# Altium schematic sheet mcu.SchDoc
size A; SheetNumber: 1; SheetTotal: 4
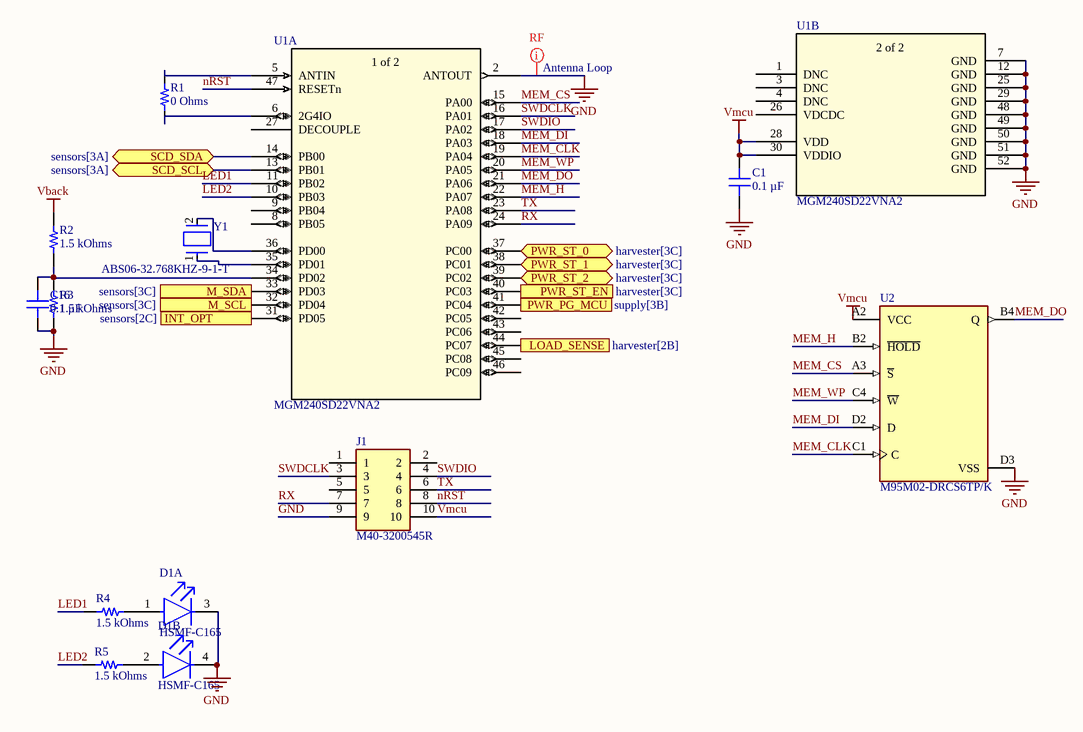
[diagram p0: mcu.SchDoc]

## Parts
C1  0.1 µF  [CAP 0402_1005]
C16  0.1 µF  [CAP 0402_1005]
D1  HSMF-C165  [FP-HSMF-C165-MFG]  (parts A,B of 2)
J1  M40-3200545R  [HARWIN_M40-3200545R]
R1  0 Ohms  [RES 0201_0603]
R2  1.5 kOhms  [RES 0402_1005]
R3  1.5 kOhms  [RES 0402_1005]
R4  1.5 kOhms  [RES 0402_1005]
R5  1.5 kOhms  [RES 0402_1005]
U1  MGM240SD22VNA2  [xGM240S]  (parts A,B of 2)
U2  M95M02-DRCS6TP/K  [FP-WLCSP8-E1c_WLCSP8_noBS-MFG]
Y1  ABS06-32.768KHZ-9-1-T  [FP-ABS06-MFG]

## Ports
INT_OPT (in, see sensors[2C]), LOAD_SENSE (see harvester[2B]), M_SCL (see sensors[3C]), M_SDA (see sensors[3C]), PWR_PG_MCU (in, see supply[3B]), PWR_ST_0 (bidir, see harvester[3C]), PWR_ST_1 (bidir, see harvester[3C]), PWR_ST_2 (bidir, see harvester[3C]), PWR_ST_EN (out, see harvester[3C]), SCD_SCL (bidir, see sensors[3A]), SCD_SDA (bidir, see sensors[3A])

## Nets
GND: C1.1 C16.1 D1.3(GREEN_C) D1.4(RED_C) J1.9 R3.2 U1.2(ANTOUT) U1.7(GND) U1.12(GND) U1.25(GND) U1.29(GND) U1.48(GND) U1.49(GND) U1.50(GND) U1.51(GND) U1.52(GND) U2.D3(VSS)
Vback: R2.1
Vmcu: C1.2 J1.10 U1.28(VDD) U1.30(VDDIO) U2.A2(VCC)
INT_OPT: U1.31(PD05) ; port INT_OPT
LED1: R4.2 U1.11(PB02)
LED2: R5.2 U1.10(PB03)
LOAD_SENSE: U1.44(PC07) ; port LOAD_SENSE
M_SCL: U1.32(PD04) ; port M_SCL
M_SDA: U1.33(PD03) ; port M_SDA
MEM_CLK: U1.19(PA04) U2.C1(C)
MEM_CS: U1.15(PA00) U2.A3(~{S})
MEM_DI: U1.18(PA03) U2.D2(D)
MEM_DO: U1.21(PA06) U2.B4(Q)
MEM_H: U1.22(PA07) U2.B2(~{HOLD})
MEM_WP: U1.20(PA05) U2.C4(~{W})
nRST: J1.8 U1.47(RESETn)
PWR_PG_MCU: U1.41(PC04) ; port PWR_PG_MCU
PWR_ST_0: U1.37(PC00) ; port PWR_ST_0
PWR_ST_1: U1.38(PC01) ; port PWR_ST_1
PWR_ST_2: U1.39(PC02) ; port PWR_ST_2
PWR_ST_EN: U1.40(PC03) ; port PWR_ST_EN
RX: J1.7 U1.24(PA09)
SCD_SCL: U1.13(PB01) ; port SCD_SCL
SCD_SDA: U1.14(PB00) ; port SCD_SDA
SWDCLK: J1.3 U1.16(PA01)
SWDIO: J1.4 U1.17(PA02)
TX: J1.6 U1.23(PA08)
NetC16_2: C16.2 R2.2 R3.1 U1.34(PD02)
NetD1_1: D1.1(GREEN_A) R4.1
NetD1_2: D1.2(RED_A) R5.1
NetR1_1: R1.1 U1.6(2G4IO)
NetR1_2: R1.2 U1.5(ANTIN)
NetU1_35: U1.35(PD01) Y1.1
NetU1_36: U1.36(PD00) Y1.2

Not connected (* = marked no-connect by the designer): J1 1 2 5; U1 1(DNC) 3(DNC) 4(DNC) 8(PB05) 9(PB04) 26(VDCDC) 27(DECOUPLE) 42(PC05) 43(PC06) 45(PC08) 46(PC09)

## Layout directives
mark named RF: GND

## Notes on the sheet
- Antenna Loop
- (in symbol MGM240SD22VNA2, part A) 1 of 2
- (in symbol MGM240SD22VNA2, part B) 2 of 2

## Library data of the parts
C1 C16 = C0402C104K7PAC7867: CAP CER 0.1UF 4V X5R 0402; manufacturer: KEMET; Tolerance: ±10%; Part Number: C0402C104K7PAC7867; Value: 0.1 µF; Applications: Bypass, Decoupling; Capacitance: 0.1 µF; componentlink1description: Datasheet; componentlink1url: https://api.kemet.com/component-edge/download/datasheet/C0402C104K7PAC7867.pdf; componentlink2description: DigiKey Link; componentlink2url: https://www.digikey.com/en/products/detail/kemet/C0402C104K7PAC7867/7381987; Device Package: 0402 (1005 Metric); lastupdated: 1/9/2022 12:30:40 pm; Lifecycle Status: Active; Minimum Order: 1; Mounting Type: Surface Mount, MLCC; Operating Temperature: -55°C ~ 85°C; Package / Case: 0402 (1005 Metric); packaging: TapeAndReel; partid: 5603; Part Status: Active; price: 0.01; series: SMD Comm X5R; Size / Dimension: 0.039" L x 0.020" W (1.00mm x 0.50mm); Supplier 1: DigiKey; Supplier Part Number 1: 399-14871-1-ND; Temperature Coefficient: X5R; Thickness (Max): 0.022" (0.55mm); Voltage - Rated: 4V
D1 = CMP-2000-06424-2: LED GREEN/RED DIFFUSED 0603 SMD; Reverse Voltage: 5V; Dominant Wavelength: 621nm; Number of Elements: 2; Shape: Rectangular; Luminous Intensity: 10mcd; Forward Current: 20mA; Lens Color: White; Illumination Color: Green; Power Dissipation: 52mW; Wavelength: 572nm; Viewing Angle: 120°; Forward Voltage: 2.2V; Max Operating Temperature: 85°C; Lens Transparency: Diffused; Width: 0.8mm; Case/Package: 0603; Packaging: Tape and Reel; Case Code (Metric): 1608; Depth: 0.8mm; REACH SVHC: No SVHC; Number of LEDs: 2; Radiation Hardening: No; Lens Style: Rectangular; Color: Green; Case Code (Imperial): 0603; Min Operating Temperature: -40°C; Power Rating: 52mW; Number of Pins: 4; Number of Terminals: 4; Package Quantity: 1; Mount: Surface Mount; Height: 0.5mm; Length: 1.6mm; Lead Free: Lead Free; Test Current: 20mA
J1 = M40-3200545R: Connector Header Surface Mount 10 position 0.039 _1.00mm_; MF: Harwin Inc.; Package: None; MP: M40-3200545R; Value: *; Price: None; SnapEDA_Link: https://www.snapeda.com/parts/M40-3200545R/Harwin%20Inc./view-part/494409/?ref=snap; Availability: Unavailable
R1 = CRG0201F10R: RES SMD 10 OHM 1% 1/20W 0201; Manufacturer: TE Connectivity Passive Product; Power (Watts): 0.05W, 1/20W; Resistance: 10 Ohms; Temperature Coefficient: ±400ppm/°C; Part Number: CRG0201F10R; Value: 0 Ohms; ComponentLink1Description: Datasheet; ComponentLink1URL: https://www.te.com/commerce/DocumentDelivery/DDEController?Action=srchrtrv&DocNm=1773204&DocType=DS&DocLang=English; ComponentLink2Description: DigiKey Link; ComponentLink2URL: https://www.digikey.com/en/products/detail/te-connectivity-passive-product/CRG0201F10R/4489648; Composition: Thick Film; Device Package: 0201 (0603 Metric); Height - Seated (Max): 0.010" (0.26mm); LastUpdated: 5/4/2023 7:30:48 PM; Lifecycle Status: Active; Minimum Order: 1; Number of Terminations: 2; Operating Temperature: -55°C ~ 155°C; Package / Case: 0201 (0603 Metric); Packaging: TapeAndReel; PartId: 3; Part Status: Active; Price: 0.02; Series: CRG, Neohm; Size / Dimension: 0.024" L x 0.012" W (0.60mm x 0.30mm); Supplier 1: DigiKey; Supplier Part Number 1: A129573CT-ND; Supplier Device Package: 0201; Tolerance: ±1%
R2-R5 = ERA-2VRW1501X: RES 1.5K OHM 0.05% 1/10W 0402; Manufacturer: Panasonic Electronic Components; Power (Watts): 0.1W, 1/10W; Temperature Coefficient: ±10ppm/°C; Part Number: ERA-2VRW1501X; Value: 1.5 kOhms; ComponentLink1Description: Datasheet; ComponentLink1URL: https://api.pim.na.industrial.panasonic.com/file_stream/main/fileversion/9152; ComponentLink2Description: DigiKey Link; ComponentLink2URL: https://www.digikey.com/en/products/detail/panasonic-electronic-components/ERA-2VRW1501X/12086957; Composition: Thin Film; Device Package: 0402 (1005 Metric); Features: Anti-Sulfur, Automotive AEC-Q200; Height - Seated (Max): 0.016" (0.40mm); LastUpdated: 11/9/2022 9:53:08 am; Lifecycle Status: Active; Minimum Order: 1; Number of Terminations: 2; Operating Temperature: -55°C ~ 155°C; Package / Case: 0402 (1005 Metric); Packaging: TapeAndReel; PartId: 67400; Part Status: Active; Price: 0.24; Ratings: AEC-Q200; Resistance: 1.5 kOhms; Series: ERA-2V; Size / Dimension: 0.039" L x 0.020" W (1.00mm x 0.50mm); Supplier 1: DigiKey; Supplier Part Number 1: 10-ERA-2VRW1501XCT-ND; Supplier Device Package: 0402; Tolerance: ±0.05%
U1 = MGM240SD22VNA2: No Description Available; Mfr_Name: Silicon Labs; RefDes: RefDes; Type: Type
U2 = CMP-12142-000007-1: IC EEPROM 2M SPI 5MHZ 8WLCSP; Manufacturer: STMicroelectronics; Standoff Height: 0.19mm; Min Supply Voltage: 1.8V; Access Time: 80ns; Nominal Supply Current: 3mA; Memory Size: 2Mbits; Max Supply Voltage: 5.5V; Ambient Temperature Range Low: -40°C; Interface: SPI; Mouser Description: EEPROM 2 Mbit serial I2C 30pF 1.8 to 5.5V; Temperature Range High: +85°C; Device Class L2: Memory; Automotive: No; ComponentLink2URL: https://www.st.com/resource/en/datasheet/m95m02-dr.pdf; Digikey Description: IC EEPROM 2M SPI 5MHZ 8WLCSP; RoHS: TRUE; Height: 0.58mm; Memory Type: EEPROM; Octopart: https://octopart.com/m95m02-drcs6tp%2Fk-stmicroelectronics-30038214; Frequency: 5MHz; Category: IC; Ambient Temperature Range High: +85°C; Lead Free: Yes; Device Class L1: Integrated Circuits (ICs); Device Class L3: EEPROM; Temperature: -40°C to +85°C; Manufacturer Part Number: M95M02-DRCS6TP/K; ComponentLink2Description: Datasheet; Package: WLCSP8-E1c_WLCSP8_noBSC; Temperature Range Low: -40°C
Y1 = CMP-27762-003430-2: Crystal 32.768kHz ±10ppm (Tol) 9pF FUND 90kΩ 2-Pin Mini-CSMD T/R; Series Resistance: 90kR; Series: ABS06; Case/Package: CSMD; Package Quantity: 3000; Load Capacitance: 9pF; Number of Pins: 2; Tolerance: 10ppm; RoHS Compliant: Yes; Depth: 1.2mm; Termination: SMD/SMT; Min Operating Temperature: -40°C; Length: 2mm; Packaging: Tape and Reel; Max Operating Temperature: 85°C; Frequency Tolerance: 10ppm; Width: 1.2mm; ESR (Equivalent Series Resistance): 90kR; Radiation Hardening: No; Frequency: 32.768kHz; REACH SVHC: No SVHC; Mount: Surface Mount; Height: 0.6mm